# EAGLE schematic ATSAMD11C14A (EAGLE 9.5.2)
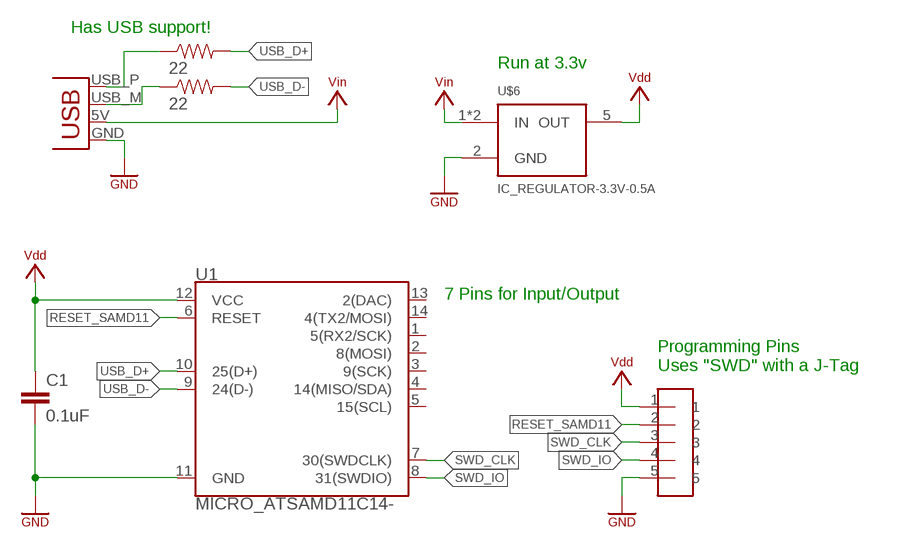
[diagram p0: schematic, sheet 1]

## Parts
C1  0.1uF  COMPONENT_CAP-0805  [0805]
R1  22  COMPONENT_RESISTOR-0805  [0805]
R2  22  COMPONENT_RESISTOR-0805  [0805]
U1  MICRO_ATSAMD11C14-  [SOIC14]
U$3  HEADER-5-TESTPOINT  [TESTPOINT-5]
U$4  CONN_USB_PCB  [USB-PCB]
U$6  IC_REGULATOR-3.3V-0.5A  [SOT23-5]

## Nets
GND: C1.2 U1.11(GND) U$3.5 U$4.GND U$6.2(GND) ; supply symbol labelled SYMBOL_GND
N$1: R1.1 U$4.USB_P(D+)
N$2: R2.1 U$4.USB_M(D-)
RESET_SAMD11: U1.6(RESET) U$3.2
SWD_CLK: U1.7(30(SWDCLK)) U$3.3
SWD_IO: U1.8(31(SWDIO)) U$3.4
USB_D+: R1.2 U1.10(25(D+))
USB_D-: R2.2 U1.9(24(D-))
VDD: C1.1 U1.12(VCC) U$3.1 U$6.5(OUT) ; supply symbol labelled SYMBOL_VDD
VIN: U$4.5V(VBUS) U$6.1(IN) U$6.3(IN) ; supply symbol labelled SYMBOL_VIN
Unconnected: U1.1(5(RX2/SCK)) U1.2(8(MOSI)) U1.3(9(SCK)) U1.4(14(MISO/SDA)) U1.5(15(SCL)) U1.13(2(DAC)) U1.14(4(TX2/MOSI))

## Notes on the sheet
- Has USB support!
- Run at 3.3v
- 7 Pins for Input/Output
- Programming Pins
  Uses "SWD" with a J-Tag

## Library data of the parts
C1 = homemade-hardware:COMPONENT_CAP: Capacitor Standard 0603 ceramic capacitor, and 0.1" leaded capacitor.
R1 R2 = homemade-hardware:COMPONENT_RESISTOR
U1 = homemade-hardware:MICRO_ATSAMD11C14: ATSAMD11C14A <https://www.digikey.com/product-detail/en/microchip-technology/ATSAMD11C14A-SSNT/ATSAMD11C14A-SSNTCT-ND/5956608>: Native USB M0 (arduino core <https://github.com/mattairtech/ArduinoCore-samd>)
U$3 = homemade-hardware:HEADER-5: NPTC081KFXC-RC <https://www.digikey.com/product-detail/en/sullins-connector-solutions/NPTC081KFXC-RC/S5600-ND/776058>: Vertical Female SMD Headers TSM-110-01-T-SV <https://www.digikey.com/product-detail/en/samtec-inc/TSM-110-01-T-SV/SAM12267-ND/6691889>: Vertical Male SMD Headers M20-8890845 <https://www.digikey.com/products/en?keywords=952-3236-ND>: Horizontal Male SMD Headers M20-7910842R <https://www.digikey.com/product-detail/en/harwin-inc/M20-7910842R/952-3200-6-ND/6559341>: Horizontal Female SMD Headers
U$4 = homemade-hardware:CONN_USB_PCB
U$6 = homemade-hardware:IC_REGULATOR: SPX3819M5-L-5-0/TR <https://www.digikey.com/product-detail/en/maxlinear-inc/SPX3819M5-L-5-0-TR/1016-1874-6-ND/3586704>: 5.0V/0.5A SMD Linear Regulator SPX3819M5-L-3-3/TR <https://www.digikey.com/product-detail/en/maxlinear-inc/SPX3819M5-L-3-3-TR/1016-1873-6-ND/3586703>: 3.3V/0.5A SMD Linear Regulator; PN: SPX3819M5-L-3-3/TR